# EAGLE design RFID_SHIELD_updated (EAGLE 8.0.1)
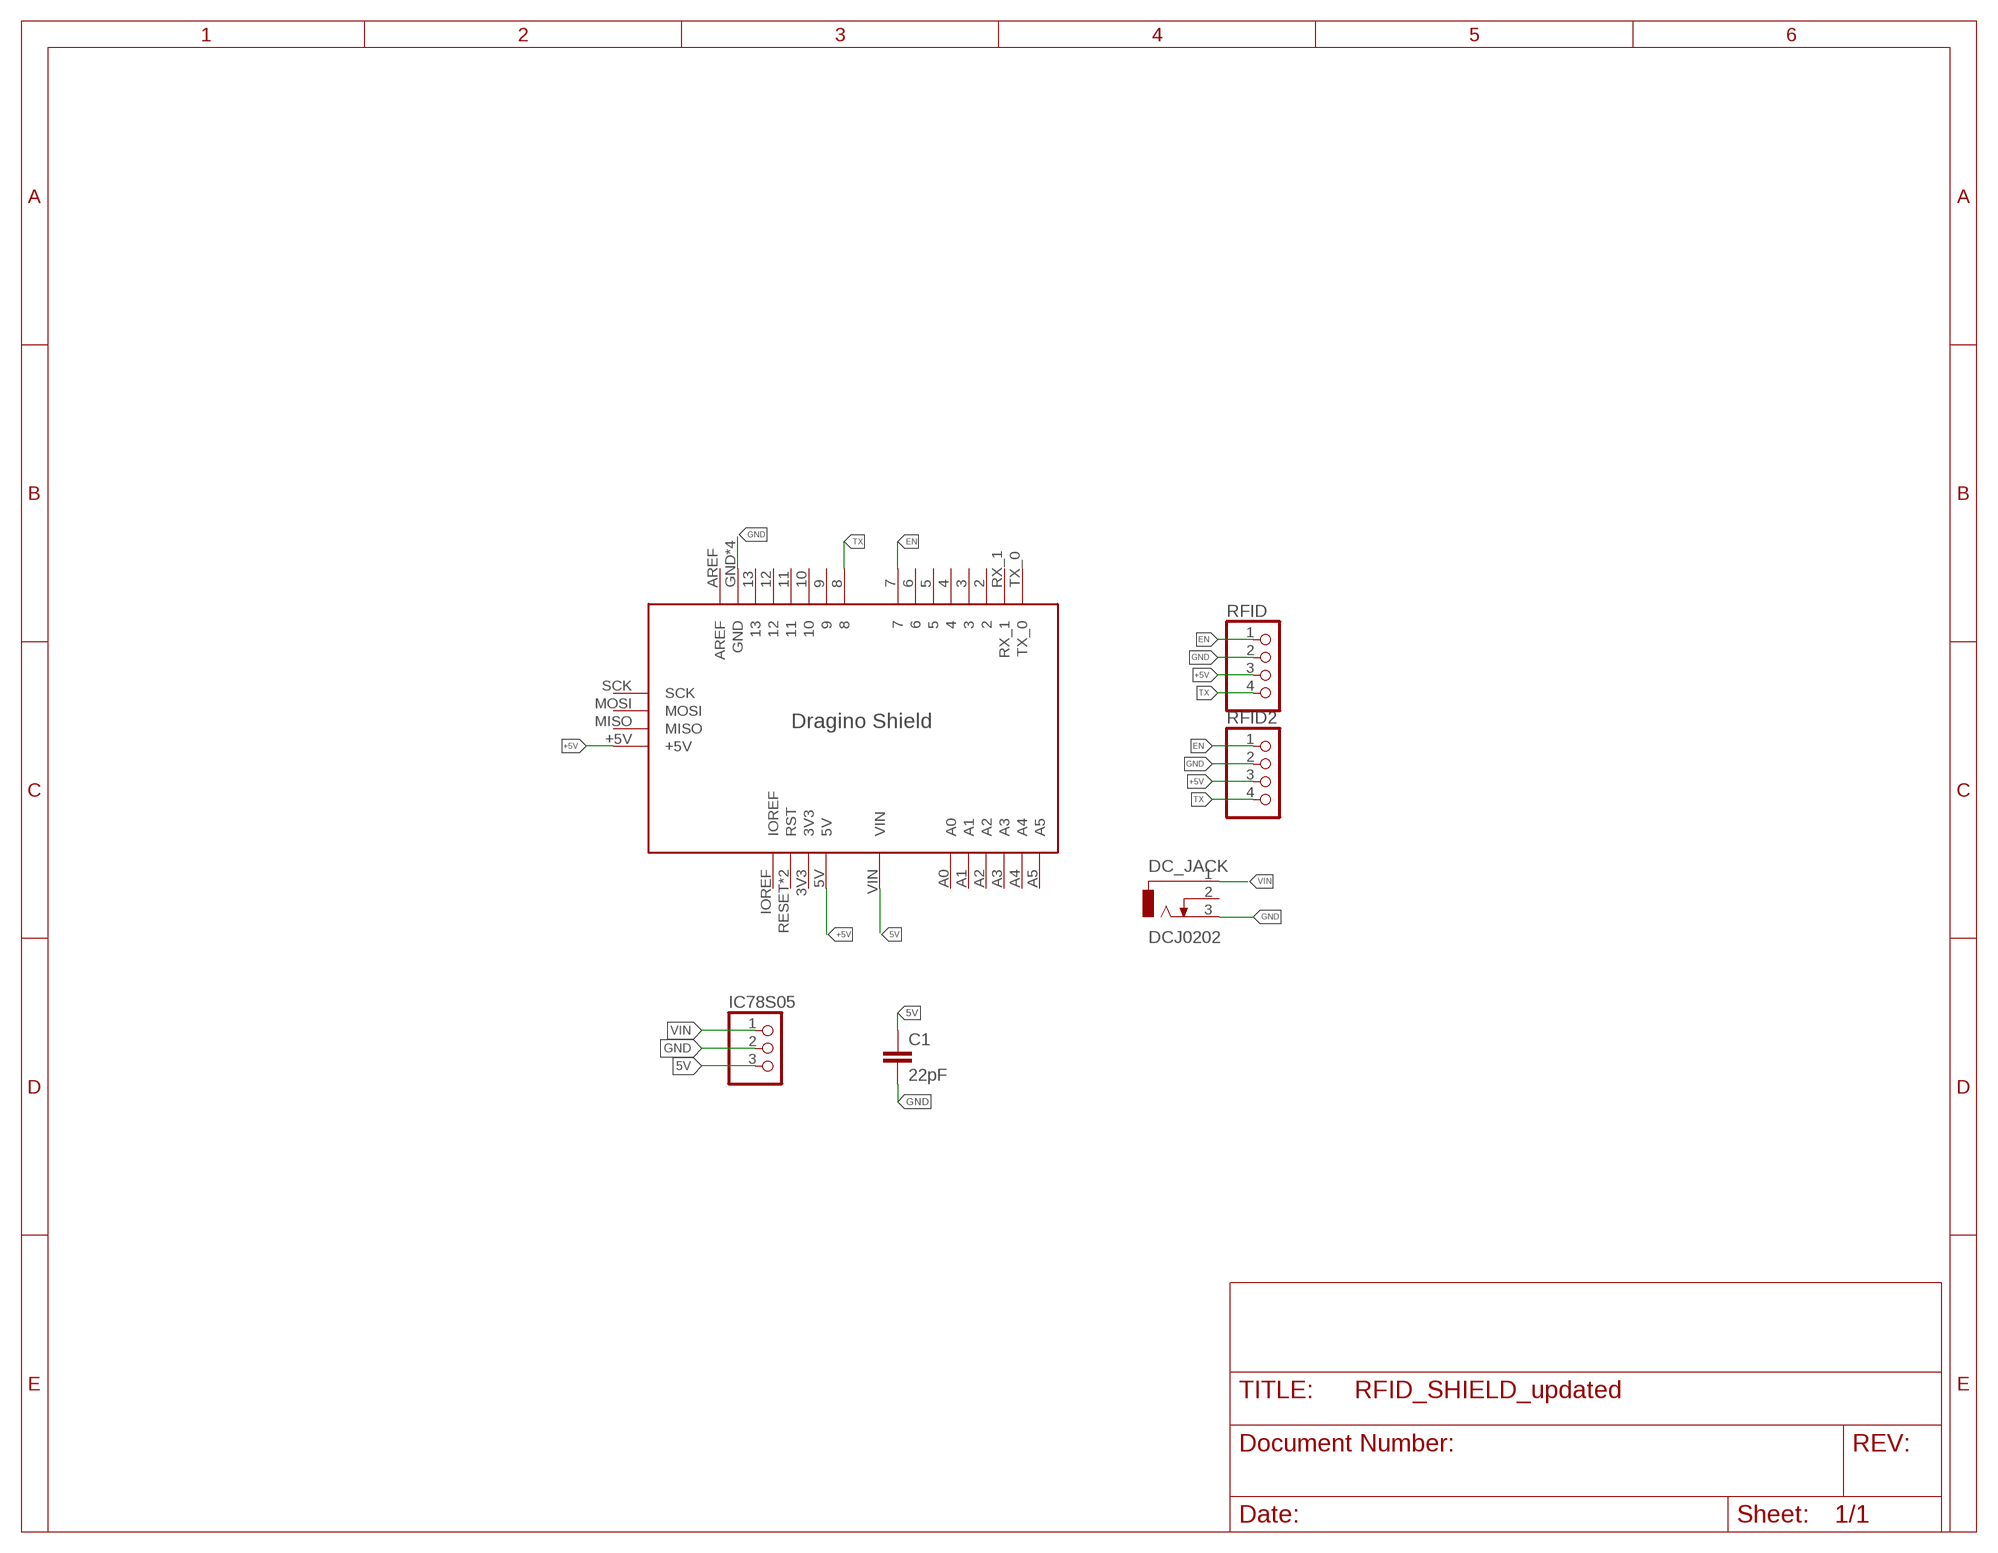
[diagram p0: schematic, sheet 1]

## Parts
C1  22pF  C2,5-3  [C2.5-3]
DC_JACK  DCJ0202  [DCJ0202]
IC78S05  PINHD-1X3  [1X03]
RFID  PINHD-1X4  [1X04]
RFID2  PINHD-1X4  [1X04]
U$1  DRAGINO_SHIELD  [DRAGINO_SHIELD]

## Nets
5V: C1.1 IC78S05.3 U$1.VIN
+5V: RFID2.3 RFID.3 U$1.5V U$1.+5V
EN: RFID2.1 RFID.1 U$1.7
GND: C1.2 DC_JACK.3 IC78S05.2 RFID2.2 RFID.2 U$1.GND U$1.GND@1(GND) U$1.GND@2(GND) U$1.GND@3(GND)
TX: RFID2.4 RFID.4 U$1.8
VIN: DC_JACK.1 IC78S05.1
Unconnected: DC_JACK.2 U$1.2 U$1.3 U$1.3V3 U$1.4 U$1.5 U$1.6 U$1.9 U$1.10 U$1.11 U$1.12 U$1.13 U$1.A0 U$1.A1 U$1.A2 U$1.A3 U$1.A4 U$1.A5 U$1.AREF U$1.IOREF U$1.MISO U$1.MOSI U$1.RESET(RST) U$1.RST U$1.RX_1 U$1.SCK U$1.TX_0

## Library data of the parts
C1 = capacitor-wima:C: CAPACITOR naming: grid - package width
DC_JACK = con-jack:DCJ0202: DC POWER JACK Source: DCJ0202.pdf; OC_FARNELL: unknown; OC_NEWARK: unknown
IC78S05 = pinhead:PINHD-1X3: PIN HEADER
RFID RFID2 = pinhead:PINHD-1X4: PIN HEADER
U$1 = Dragino_shield:DRAGINO_SHIELD

## Board
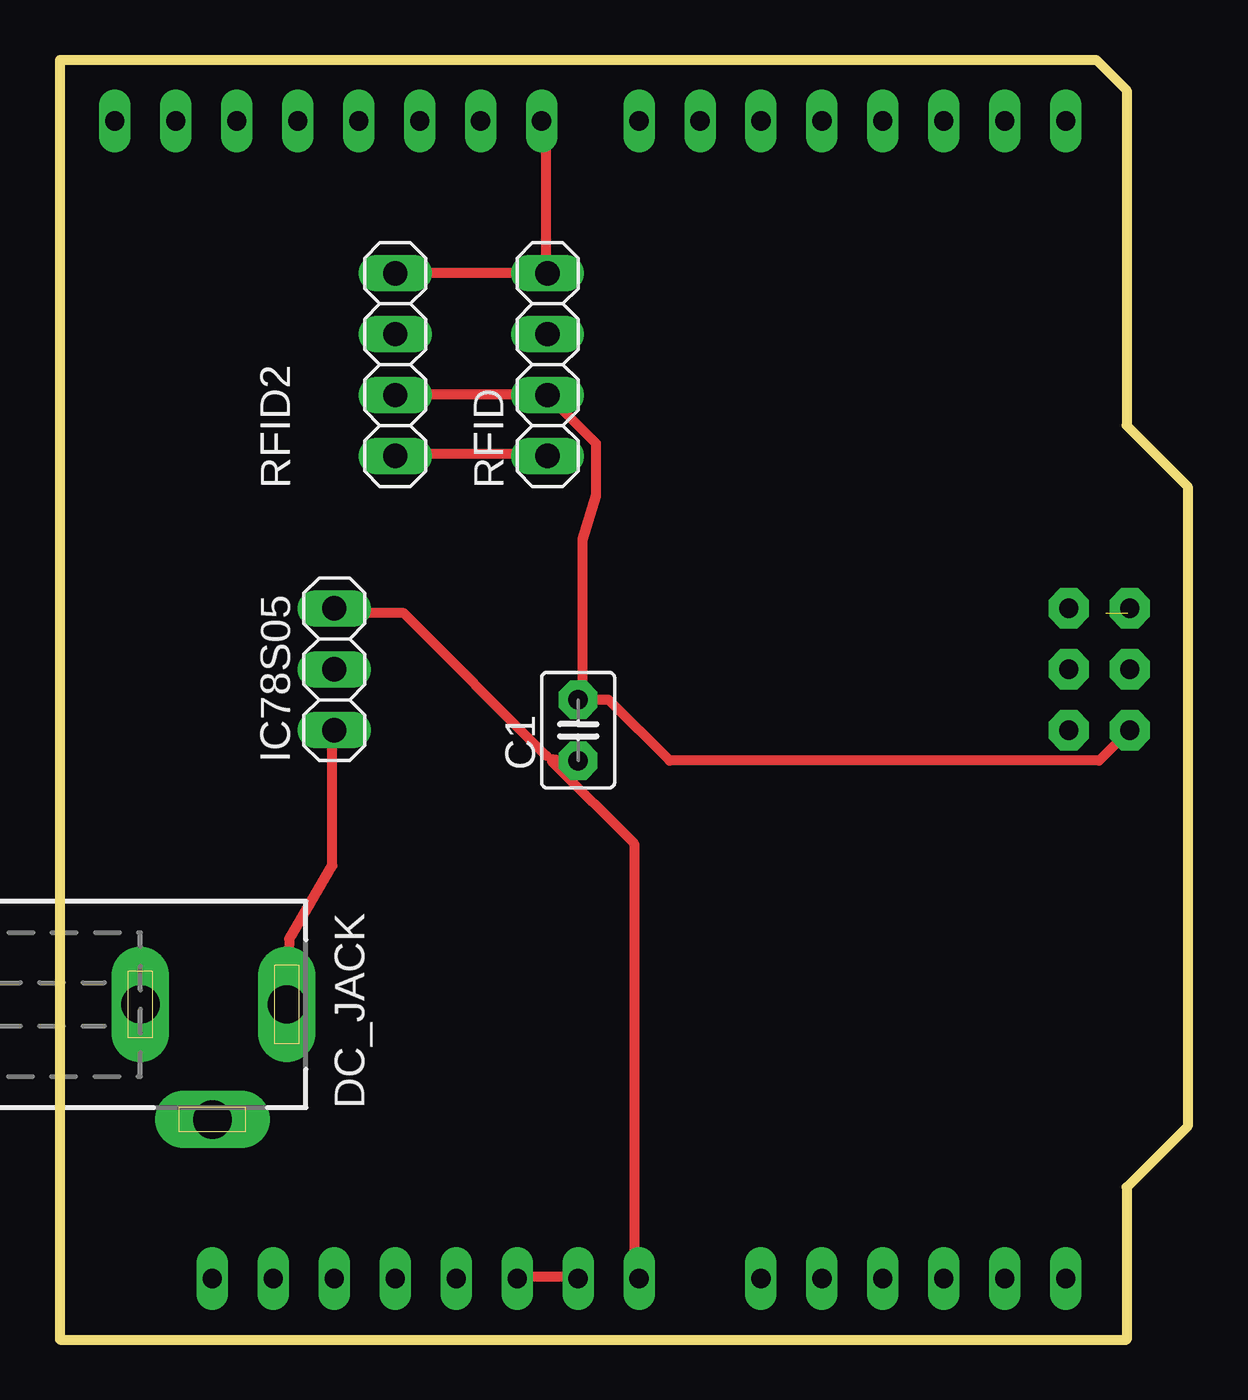
[diagram p1: board, top side]
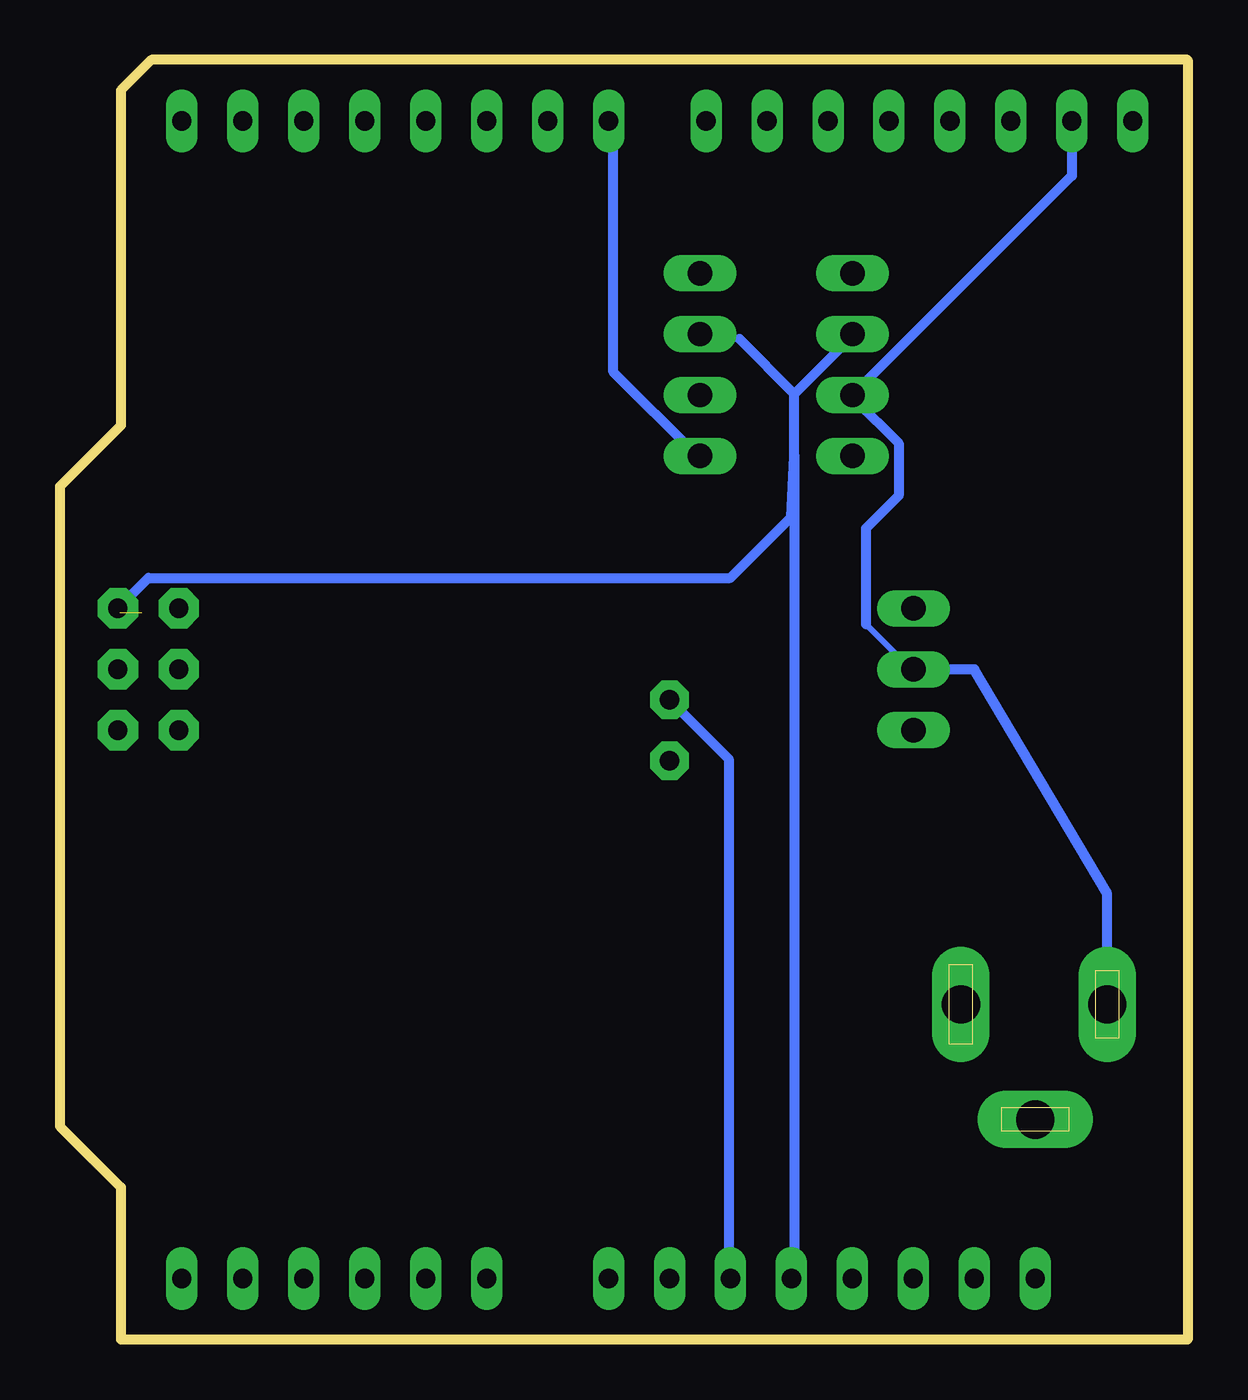
[diagram p2: board, bottom side, seen from below]

Size 46.99 x 53.34 mm. Coordinates in mm from the lower left corner, seen from the top.
Copper layers (1*16): Top 0.035mm / dielectric 1.5mm / Bottom 0.035mm
Design rules "default": minimum track width 10mil, minimum drill 24mil, track to track 8mil, track to pad 8mil, pad to pad 8mil, via to via 8mil, smd to smd 8mil, copper to edge 40mil, drill to drill 8mil, minimum pad ring 10mil, minimum via ring 8mil, stop-mask expansion 4mil, vias tented up to drill 0mil, thermal gap 10mil

### Footprints (pad centres in the part's own frame; a part is rotated, then mirrored left to right if it is on the bottom)
C2.5-3 = drill 0.813 pad 1.6 octagon: 1 -1.27,0; 2 1.27,0
DCJ0202 = drill 1.6 pad 2 long: 1 0,3.1; 2 4.8,0; 3 0,-3
1X03 = drill 1.016 long: 1 -2.54,0; 2 0,0; 3 2.54,0
1X04 = drill 1.016 long: 1 -3.81,0; 2 -1.27,0; 3 1.27,0; 4 3.81,0
DRAGINO_SHIELD = drill 0.8 long: 2 36.83,50.8; 3 34.29,50.8; 3V3 13.97,2.54; 4 31.75,50.8; 5 29.21,50.8; 5V 16.51,2.54; 6 26.67,50.8; 7 24.13,50.8; 8 20.066,50.8; 9 17.526,50.8; 10 14.986,50.8; 11 12.446,50.8; 12 9.906,50.8; 13 7.366,50.8; A0 29.21,2.54; A1 31.75,2.54; A2 34.29,2.54; A3 36.83,2.54; A4 39.37,2.54; A5 41.91,2.54; AREF 2.286,50.8; GND@1 4.826,50.8; GND@2 21.59,2.54; GND@3 19.05,2.54; IOREF 8.89,2.54; P$32 6.35,2.54; RST 11.43,2.54; RX_1 39.37,50.8; TX_0 41.91,50.8; VIN 24.13,2.54 | drill 0.8 pad 1.676 octagon: +5V 44.577,30.481; GND 44.577,25.401; MISO 42.037,30.481; MOSI 44.577,27.941; RESET 42.037,25.401; SCK 42.037,27.941

### Placement (x,y rotation side)
C1  21.59,25.4 90 top
DC_JACK  6.35,13.97 270 top
IC78S05  11.43,27.94 90 top
RFID  20.32,40.64 90 top
RFID2  13.97,40.64 90 top
U$1  0,0 0 top

### Tracks (layer width: path | path; a pad name or v marks a point on that pad's centre or on a via)
5V
  Top 0.254: 23.93,2.62 U$1.VIN | 20.5,24.11 C1.1 20.27,24.33 | 11.58,30.28 IC78S05.3
  Top 0.406: 23.93,2.62 23.93,20.68 20.5,24.11 | 11.58,30.28 14.33,30.28 20.27,24.33
+5V  (1 unrouted)
  Bottom 0.254: 16.38,2.62 U$1.5V | 14.1,41.71 RFID2.3 | 18.67,41.71 20.27,41.71 RFID.3 | 44.5,30.28 U$1.+5V
  Bottom 0.406: 16.38,36.83 16.38,39.42 | 16.38,36.83 16.38,2.62 | 14.1,41.71 16.38,39.42 | 16.38,39.42 18.67,41.71 | U$1.+5V 43.31,31.75 19.05,31.75 16.51,34.29 16.38,36.83
EN
  Top 0.254: 14.1,36.91 RFID2.1 | 20.27,36.91 RFID.1
  Top 0.406: 20.27,36.91 14.1,36.91
  Bottom 0.254: 23.93,50.62 U$1.7 | 20.5,36.91 RFID.1
  Bottom 0.406: 23.93,50.62 23.93,40.33 20.5,36.91
GND
  Top 0.254: 19.13,2.62 U$1.GND@3 | 21.41,2.62 U$1.GND@2 | 4.95,50.62 U$1.GND@1 | 13.87,39.42 RFID2.2 14.1,39.42 | 20.27,39.42 RFID.2 | C1.2 21.77,26.85
  Top 0.406: 21.41,2.62 19.13,2.62 | 14.1,39.42 20.27,39.42 | 21.77,26.85 21.77,33.35 22.33,35.18 22.33,37.36 RFID.2 | U$1.GND 43.31,24.13 25.4,24.13 22.86,26.67 C1.2
  Bottom 0.254: 13.41,29.82 11.58,27.99 IC78S05.2 | RFID2.2 13.87,39.19 | 19.13,2.62 U$1.GND@3
  Bottom 0.406: 13.41,29.82 13.41,33.81 12.04,35.18 12.04,37.36 13.87,39.19 | 19.13,2.62 19.13,24.21 C1.2 | DC_JACK.3 3.35,18.59 8.89,27.94 IC78S05.2 | U$1.GND@1 4.83,48.51 RFID2.2
TX
  Top 0.254: 20.27,50.62 U$1.8 | 20.27,44.45 RFID.4
  Top 0.406: 20.27,50.62 20.27,44.45 RFID2.4
VIN
  Top 0.254: 11.35,25.25 IC78S05.1
  Top 0.406: 11.35,25.25 11.35,19.76 9.55,16.69 DC_JACK.1